# EAGLE design m1k-scope-probe (EAGLE 7.7.0)
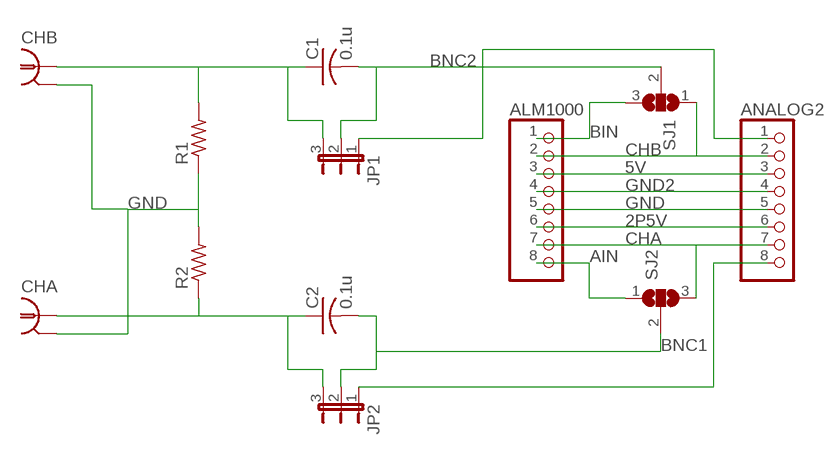
[diagram p0: schematic, sheet 1]

## Parts
ALM1000  PINHD-1X8  [1X08]
ANALOG2  PINHD-1X8  [1X08]
C1  0.1u  C-US050-024X044  [C050-024X044]
C2  0.1u  C-US050-024X044  [C050-024X044]
CHA  227161-8  [AMP_227161]
CHB  227161-8  [AMP_227161]
JP1  JP2E  [JP2]
JP2  JP2E  [JP2]
R1  R-US_0204/7  [0204/7]
R2  R-US_0204/7  [0204/7]
SJ1  SJ2W  [SJ_2]
SJ2  SJ2W  [SJ_2]

## Nets
2P5V: ALM1000.6 ANALOG2.6
5V: ALM1000.3 ANALOG2.3
AIN: ALM1000.8 SJ2.1
BIN: ALM1000.1 SJ1.3
BNC1: C2.2 JP2.2 SJ2.2
BNC2: C1.2 JP1.2 SJ1.2
CHA: ALM1000.7 ANALOG2.7 SJ2.3
CHB: ALM1000.2 ANALOG2.2 SJ1.1
GND: ALM1000.5 ANALOG2.5 CHA.2(GND) CHB.2(GND) R1.1 R2.2
GND2: ALM1000.4 ANALOG2.4
N$1: ANALOG2.8 JP2.1
N$2: C1.1 CHB.1 JP1.3 R1.2
N$3: ANALOG2.1 JP1.1
N$5: C2.1 CHA.1 JP2.3 R2.1

## Library data of the parts
ALM1000 ANALOG2 = pinhead:PINHD-1X8: PIN HEADER
C1 C2 = rcl:C-US: CAPACITOR, American symbol
CHA CHB = con-coax:?227161*: JACK, RIGHT ANGLE, 50 OHM, PCB, BNC Source: amp_227161.pdf; OC_FARNELL: unknown; OC_NEWARK: unknown
JP1 JP2 = jumper:JP2E: JUMPER
R1 R2 = resistor:R-US_: RESISTOR, American symbol
SJ1 SJ2 = jumper:SJ2W: SMD solder JUMPER

## Board
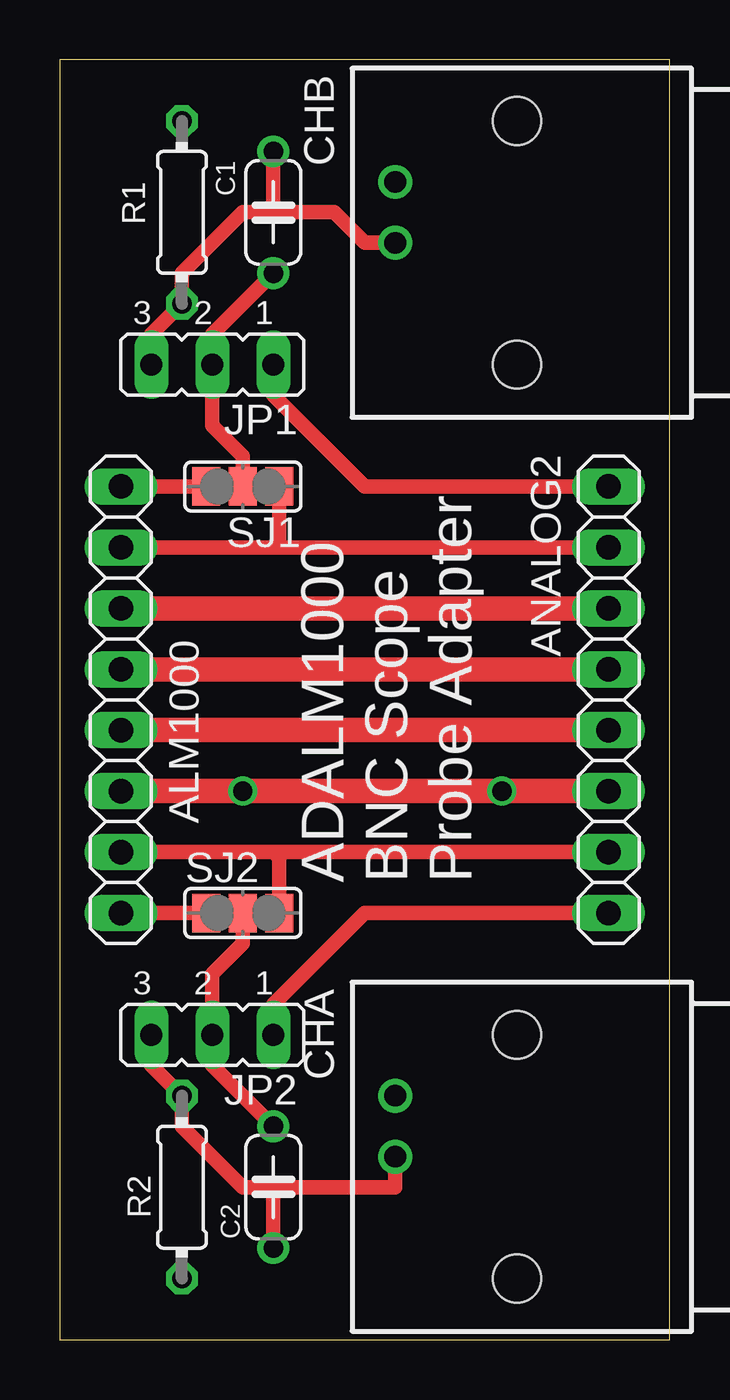
[diagram p1: board, top side]
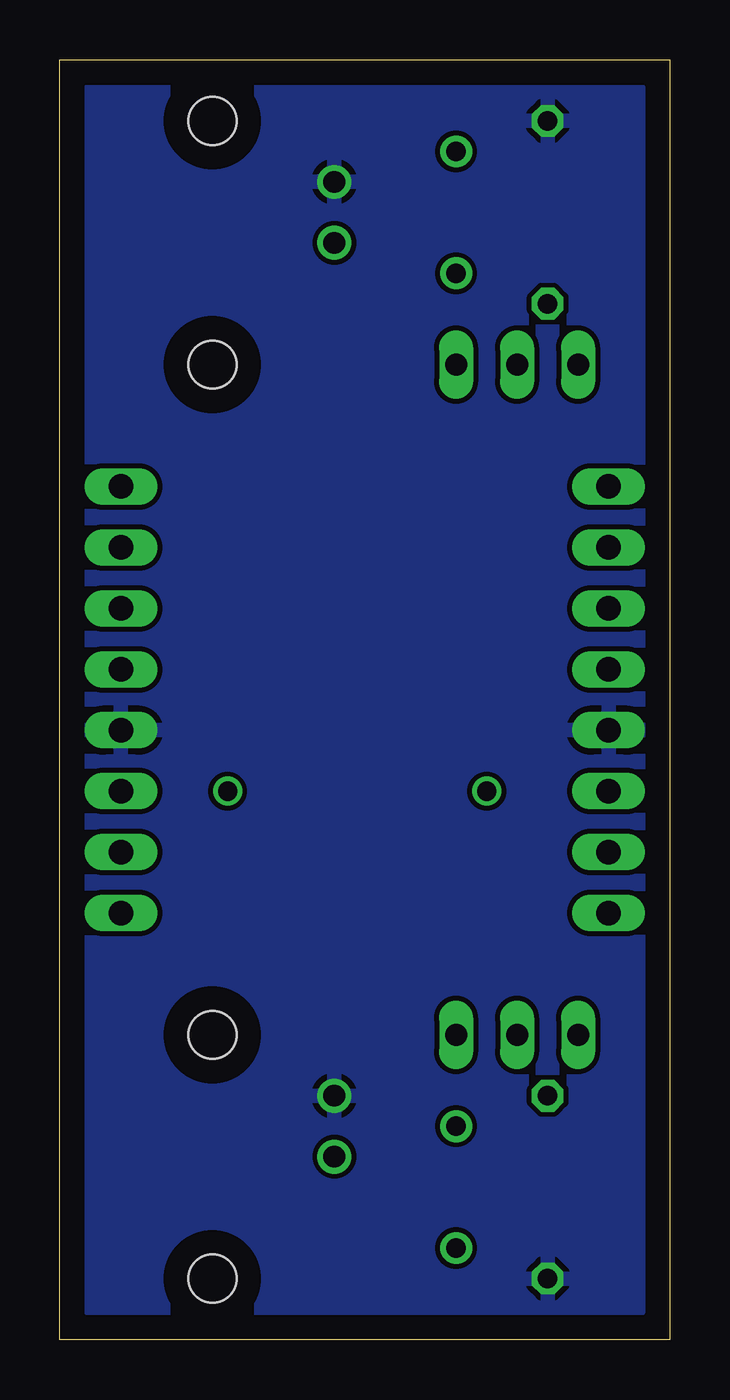
[diagram p2: board, bottom side, seen from below]

Size 25.4 x 53.34 mm. Coordinates in mm from the lower left corner, seen from the top.
Outline: 0,0 25.4,0 25.4,53.34 0,53.34 0,0
Copper layers (1*16): Top 0.035mm / dielectric 1.5mm / Bottom 0.035mm
Design rules "default": minimum track width 10mil, minimum drill 24mil, track to track 8mil, track to pad 8mil, pad to pad 8mil, via to via 8mil, smd to smd 8mil, copper to edge 40mil, drill to drill 8mil, minimum pad ring 10mil, minimum via ring 8mil, stop-mask expansion 4mil, vias tented up to drill 0mil, thermal gap 10mil

### Footprints (pad centres in the part's own frame; a part is rotated, then mirrored left to right if it is on the bottom)
1X08 = drill 1.016 long: 1 -8.89,0; 2 -6.35,0; 3 -3.81,0; 4 -1.27,0; 5 1.27,0; 6 3.81,0; 7 6.35,0; 8 8.89,0
C050-024X044 = drill 0.813: 1 -2.54,0; 2 2.54,0
AMP_227161 = drill 0.9 pad 1.27: 1 0,-5.08; 2 -2.54,-5.08 | hole 2: -5.08,0; 5.08,0
JP2 = drill 0.914 long: 1 -2.54,0; 2 0,0; 3 2.54,0
0204/7 = drill 0.813 octagon: 1 -3.81,0; 2 3.81,0
SJ_2 = smd 1.168 x 1.6: 1 -1.524,0; 2 0,0; 3 1.524,0

### Placement (x,y rotation side)
ALM1000  2.54,26.67 270 top
ANALOG2  22.86,26.67 270 top
C1  8.89,46.99 270 top
C2  8.89,6.35 90 top
CHA  19.05,7.62 270 top
CHB  19.05,45.72 270 top
JP1  6.35,40.64 180 top
JP2  6.35,12.7 180 top
R1  5.08,46.99 270 top
R2  5.08,6.35 270 top
SJ1  7.62,35.56 180 top
SJ2  7.62,17.78 0 top

### Tracks (layer width: path | path; a pad name or v marks a point on that pad's centre or on a via)
2P5V  (via drill 0.8)
  Top 1.016: ALM1000.6 v7.62,22.86 v18.41,22.86 ANALOG2.6
5V
  Top 1.016: ALM1000.3 ANALOG2.3
AIN
  Top 0.61: ALM1000.8 SJ2.1
BIN
  Top 0.61: ALM1000.1 SJ1.3
BNC1
  Top 0.61: C2.2 6.35,11.43 JP2.2 6.35,15.24 7.62,16.51 SJ2.2
BNC2
  Top 0.61: C1.2 6.35,41.91 JP1.2 6.35,38.1 7.62,36.83 SJ1.2
CHA
  Top 0.61: ALM1000.7 8.89,20.32 | 8.89,20.32 ANALOG2.7 | SJ2.3 9.14,20.07 8.89,20.32
CHB
  Top 0.61: ALM1000.2 8.89,33.02 | 8.89,33.02 ANALOG2.2 | SJ1.1 9.14,33.27 8.89,33.02
GND
  Top 1.016: ALM1000.5 ANALOG2.5
  pour Bottom: 1.27,1.27 24.13,1.27 24.13,52.07 1.27,52.07
GND2
  Top 1.016: ALM1000.4 ANALOG2.4
N$1
  Top 0.61: ANALOG2.8 12.7,17.78 8.89,13.97 JP2.1
N$2
  Top 0.61: CHB.1 12.7,45.72 11.43,46.99 8.89,46.99 | 8.89,46.99 C1.1 | JP1.3 3.81,41.91 R1.2 5.08,44.45 7.62,46.99 8.89,46.99
N$3
  Top 0.61: ANALOG2.1 12.7,35.56 8.89,39.37 JP1.1
N$5
  Top 0.61: CHA.1 13.97,6.35 8.89,6.35 | C2.1 8.89,6.35 | 8.89,6.35 7.62,6.35 5.08,8.89 R2.1 3.81,11.43 JP2.3

### Text on the board
tNames: ADALM1000 / BNC Scope / Probe Adapter